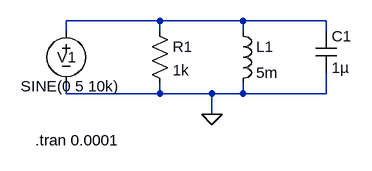
[diagram p0: schematic LCR Parallel Circuit.asc]
LCR Parallel Circuit.asc, the LTspice schematic file:
Version 4
SHEET 1 880 680
WIRE 192 112 48 112
WIRE 320 112 192 112
WIRE 448 112 320 112
WIRE 48 128 48 112
WIRE 192 128 192 112
WIRE 320 128 320 112
WIRE 448 128 448 112
WIRE 48 224 48 208
WIRE 192 224 192 208
WIRE 192 224 48 224
WIRE 272 224 192 224
WIRE 320 224 320 208
WIRE 320 224 272 224
WIRE 448 224 448 192
WIRE 448 224 320 224
WIRE 272 256 272 224
FLAG 272 256 0
SYMBOL voltage 48 112 R0
WINDOW 0 -14 56 Left 2
WINDOW 3 -70 101 Left 2
WINDOW 123 0 0 Left 0
WINDOW 39 0 0 Left 0
SYMATTR InstName V1
SYMATTR Value SINE(0 5 10k)
SYMBOL res 176 112 R0
SYMATTR InstName R1
SYMATTR Value 1k
SYMBOL ind 304 112 R0
SYMATTR InstName L1
SYMATTR Value 5m
SYMBOL cap 432 128 R0
SYMATTR InstName C1
SYMATTR Value 1µ
TEXT 0 296 Left 2 !.tran 0.0001

The netlist it stands for:
* LCR Parallel Circuit.asc
V1 N001 0 SINE(0 5 10k)
R1 N001 0 1k
L1 N001 0 5m
C1 N001 0 1µ
.tran 0.0001
.backanno
.end